# Altium schematic sheet OLD_REGENIX_Relais.SchDoc
size Tabloid; Date: Date; Author: Author 1; DocumentNumber: 2; Revision: 1; SheetNumber: 6; SheetTotal: 12; Size: 11x17; Sheet_Name: BATTERY PROTECTION & AUXILIARY
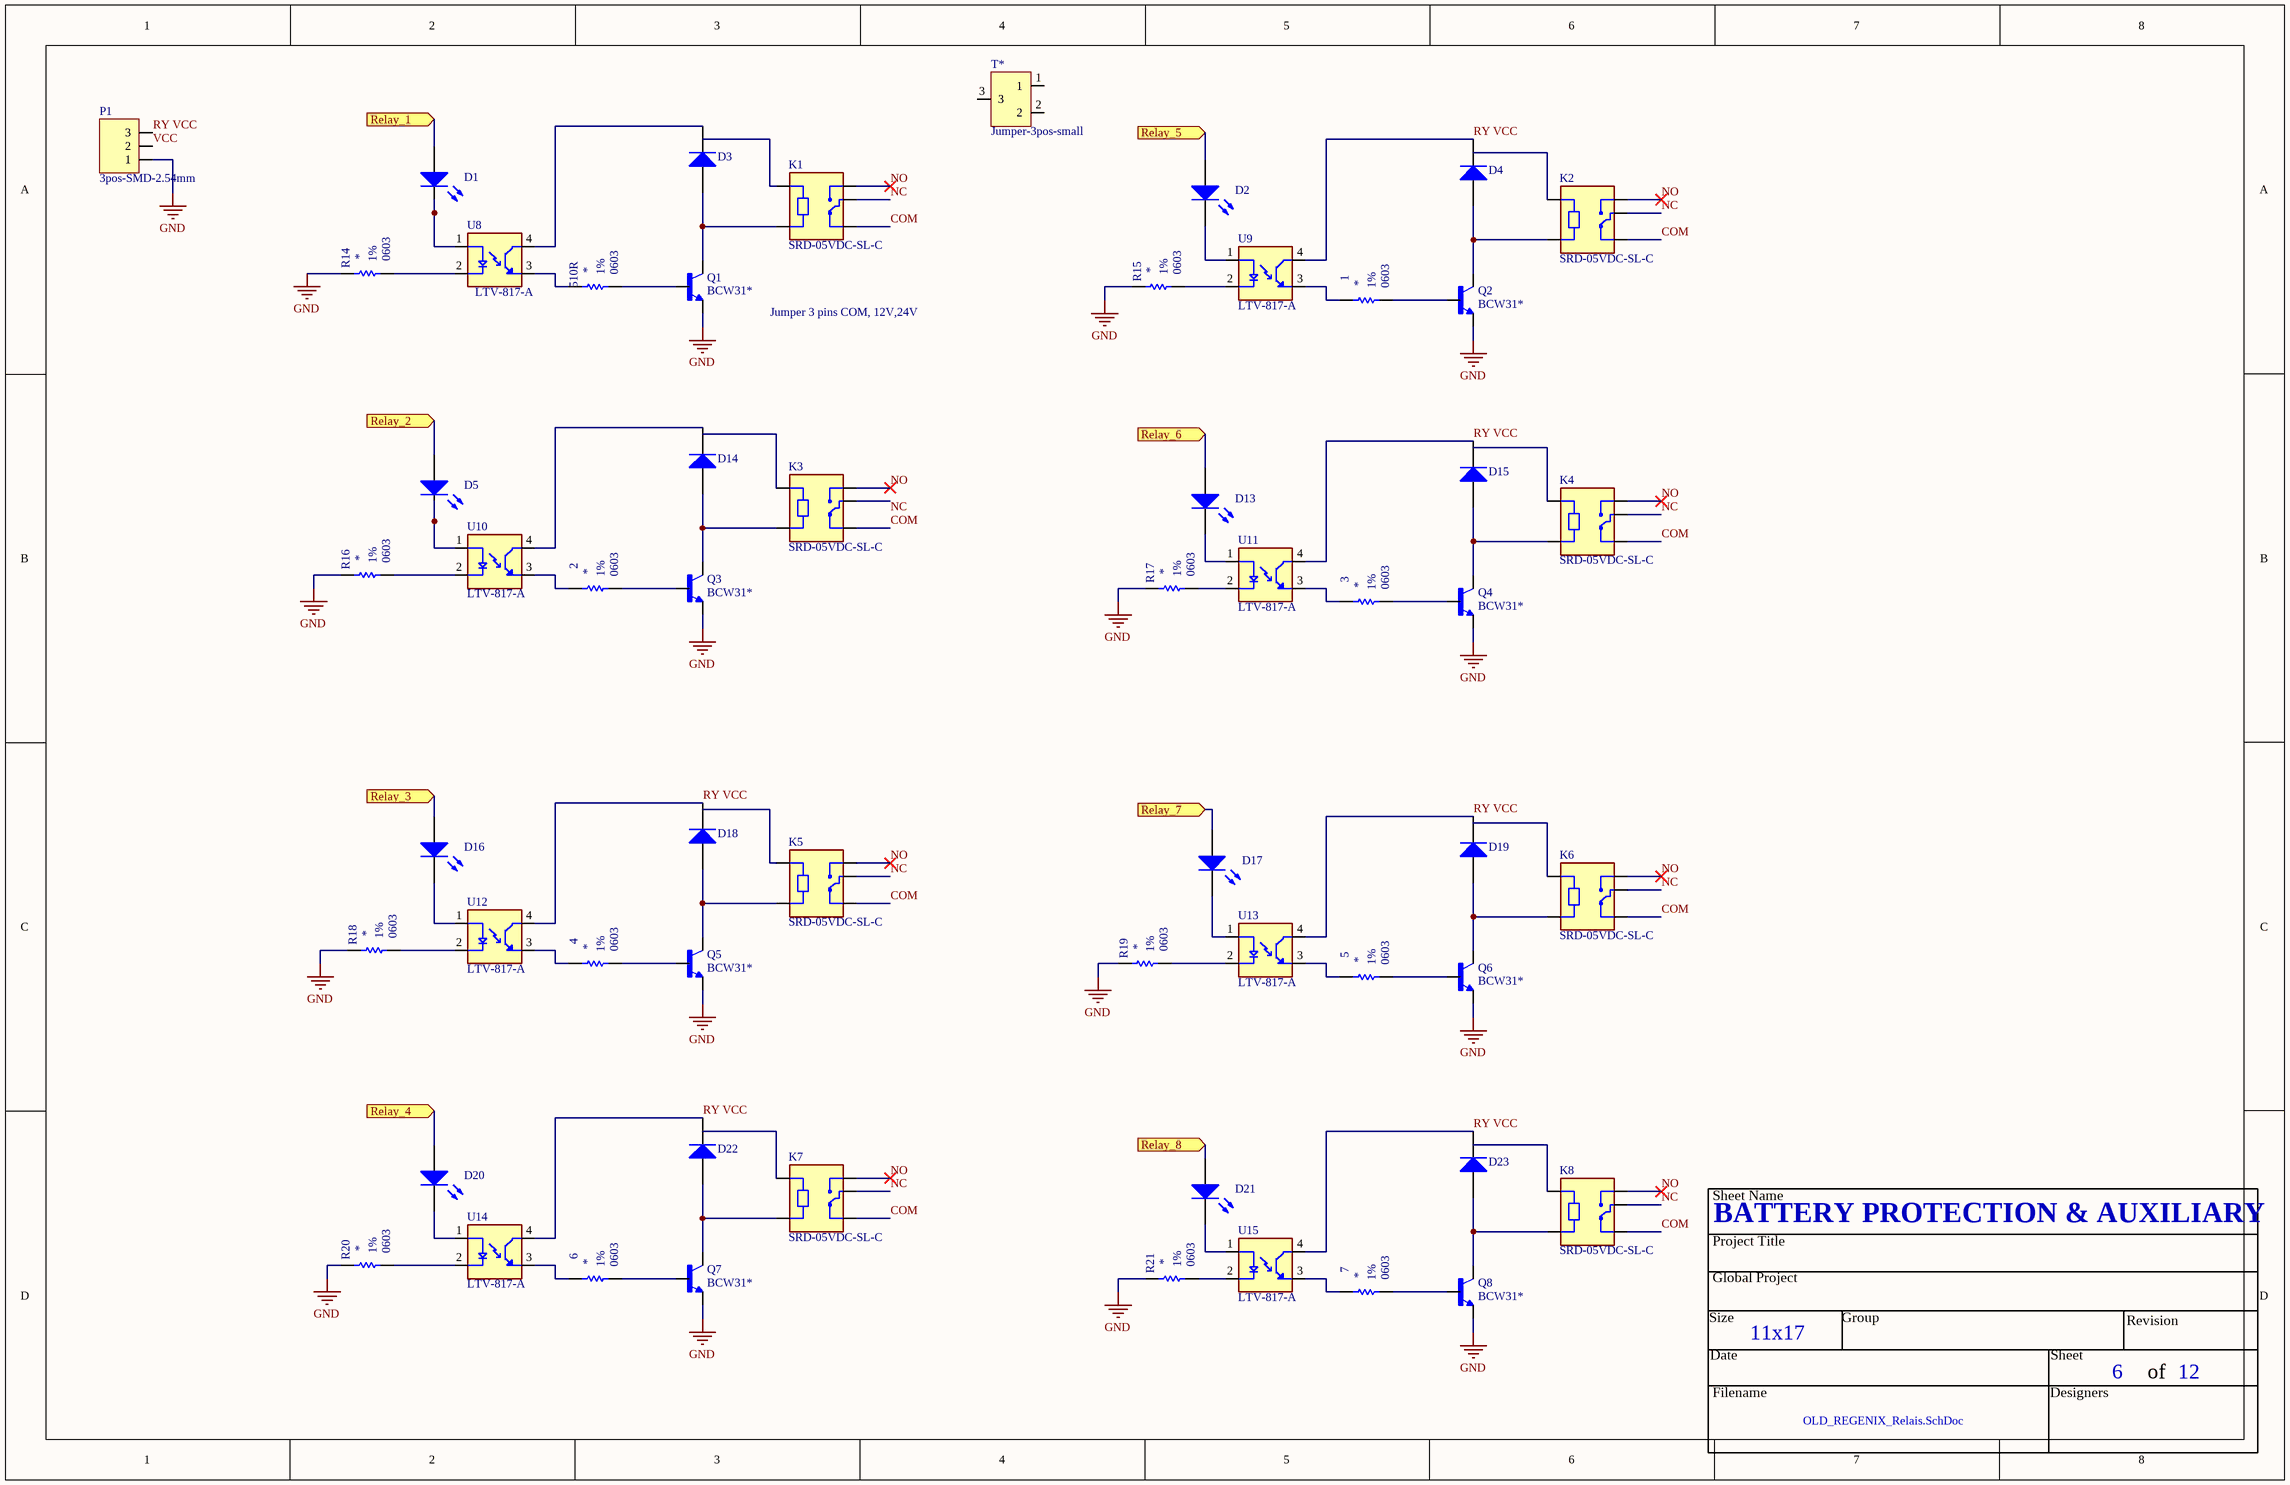
[diagram p0: OLD_REGENIX_Relais.SchDoc]

## Parts
1  Package: 0603  Precision: 1%  [RES_0603]  (hidden comment: RES - 0603)
2  Package: 0603  Precision: 1%  [RES_0603]  (hidden comment: RES - 0603)
3  Package: 0603  Precision: 1%  [RES_0603]  (hidden comment: RES - 0603)
4  Package: 0603  Precision: 1%  [RES_0603]  (hidden comment: RES - 0603)
5  Package: 0603  Precision: 1%  [RES_0603]  (hidden comment: RES - 0603)
6  Package: 0603  Precision: 1%  [RES_0603]  (hidden comment: RES - 0603)
7  Package: 0603  Precision: 1%  [RES_0603]  (hidden comment: RES - 0603)
510R  Package: 0603  Precision: 1%  [RES_0603]  (hidden comment: RES - 0603)
D1  Light-Emitting Diode  (value not drawn)
D2  Light-Emitting Diode  (value not drawn)
D3  Diode  (value not drawn)
D4  Diode  (value not drawn)
D5  Light-Emitting Diode  (value not drawn)
D13  Light-Emitting Diode  (value not drawn)
D14  Diode  (value not drawn)
D15  Diode  (value not drawn)
D16  Light-Emitting Diode  (value not drawn)
D17  Light-Emitting Diode  (value not drawn)
D18  Diode  (value not drawn)
D19  Diode  (value not drawn)
D20  Light-Emitting Diode  (value not drawn)
D21  Light-Emitting Diode  (value not drawn)
D22  Diode  (value not drawn)
D23  Diode  (value not drawn)
K1  SRD-05VDC-SL-C  [RELAY_SRD-05VDC-SL-C]
K2  SRD-05VDC-SL-C  [RELAY_SRD-05VDC-SL-C]
K3  SRD-05VDC-SL-C  [RELAY_SRD-05VDC-SL-C]
K4  SRD-05VDC-SL-C  [RELAY_SRD-05VDC-SL-C]
K5  SRD-05VDC-SL-C  [RELAY_SRD-05VDC-SL-C]
K6  SRD-05VDC-SL-C  [RELAY_SRD-05VDC-SL-C]
K7  SRD-05VDC-SL-C  [RELAY_SRD-05VDC-SL-C]
K8  SRD-05VDC-SL-C  [RELAY_SRD-05VDC-SL-C]
P1  3pos-SMD-2.54mm  [HDR1X3 - PAD]
Q1  BCW31*  [SOT23-BEC]
Q2  BCW31*  [SOT23-BEC]
Q3  BCW31*  [SOT23-BEC]
Q4  BCW31*  [SOT23-BEC]
Q5  BCW31*  [SOT23-BEC]
Q6  BCW31*  [SOT23-BEC]
Q7  BCW31*  [SOT23-BEC]
Q8  BCW31*  [SOT23-BEC]
R14  Package: 0603  Precision: 1%  [RES_0603]  (hidden comment: RES - 0603)
R15  Package: 0603  Precision: 1%  [RES_0603]  (hidden comment: RES - 0603)
R16  Package: 0603  Precision: 1%  [RES_0603]  (hidden comment: RES - 0603)
R17  Package: 0603  Precision: 1%  [RES_0603]  (hidden comment: RES - 0603)
R18  Package: 0603  Precision: 1%  [RES_0603]  (hidden comment: RES - 0603)
R19  Package: 0603  Precision: 1%  [RES_0603]  (hidden comment: RES - 0603)
R20  Package: 0603  Precision: 1%  [RES_0603]  (hidden comment: RES - 0603)
R21  Package: 0603  Precision: 1%  [RES_0603]  (hidden comment: RES - 0603)
T*  Jumper-3pos-small  [Jumper-3pos-small]
U8  LTV-817-A  [DIP762W50P254L510H500Q4]
U9  LTV-817-A  [DIP762W50P254L510H500Q4]
U10  LTV-817-A  [DIP762W50P254L510H500Q4]
U11  LTV-817-A  [DIP762W50P254L510H500Q4]
U12  LTV-817-A  [DIP762W50P254L510H500Q4]
U13  LTV-817-A  [DIP762W50P254L510H500Q4]
U14  LTV-817-A  [DIP762W50P254L510H500Q4]
U15  LTV-817-A  [DIP762W50P254L510H500Q4]

## Ports
Relay_1 (in), Relay_2 (in), Relay_3 (in), Relay_4 (in), Relay_5 (in), Relay_6 (in), Relay_7 (in), Relay_8 (in)

## Nets
GND: P1.1 Q1.E Q2.E Q3.E Q4.E Q5.E Q6.E Q7.E Q8.E R14.2 R15.2 R16.2 R17.2 R18.2 R19.2 R20.2 R21.2
COM: K1.NC K2.NC K3.NC K4.NC K5.NC K6.NC K7.NC K8.NC
NC: K1.COM K2.COM K4.COM K5.COM K6.COM K7.COM K8.COM
NO: K1.NO K2.NO K3.NO K4.NO K5.NO K6.NO K7.NO K8.NO
Relay_1: D1.1(A) ; port Relay_1
Relay_2: D5.1(A) ; port Relay_2
Relay_3: D16.1(A) ; port Relay_3
Relay_4: D20.1(A) ; port Relay_4
Relay_5: D2.1(A) ; port Relay_5
Relay_6: D13.1(A) ; port Relay_6
Relay_7: D17.1(A) ; port Relay_7
Relay_8: D21.1(A) ; port Relay_8
RY VCC: D4.2(K) D15.2(K) D18.2(K) D19.2(K) D22.2(K) D23.2(K) P1.3 U9.4(CT) U11.4(CT) U12.4(CT) U13.4(CT) U14.4(CT) U15.4(CT)
VCC: P1.2
Net1_1: 1.1 Q2.B
Net1_2: 1.2 U9.3(ET)
Net2_1: 2.1 Q3.B
Net2_2: 2.2 U10.3(ET)
Net3_1: 3.1 Q4.B
Net3_2: 3.2 U11.3(ET)
Net4_1: 4.1 Q5.B
Net4_2: 4.2 U12.3(ET)
Net5_1: 5.1 Q6.B
Net5_2: 5.2 U13.3(ET)
Net6_1: 6.1 Q7.B
Net6_2: 6.2 U14.3(ET)
Net7_1: 7.1 Q8.B
Net7_2: 7.2 U15.3(ET)
Net510R_1: 510R.1 Q1.B
Net510R_2: 510R.2 U8.3(ET)
NetD1_2: D1.2(K) U8.1(A)
NetD2_2: D2.2(K) U9.1(A)
NetD3_1: D3.1(A) K1.A2 Q1.C
NetD3_2: D3.2(K) U8.4(CT)
NetD4_1: D4.1(A) K2.A2 Q2.C
NetD5_2: D5.2(K) U10.1(A)
NetD13_2: D13.2(K) U11.1(A)
NetD14_1: D14.1(A) K3.A2 Q3.C
NetD14_2: D14.2(K) U10.4(CT)
NetD15_1: D15.1(A) K4.A2 Q4.C
NetD16_2: D16.2(K) U12.1(A)
NetD17_2: D17.2(K) U13.1(A)
NetD18_1: D18.1(A) K5.A2 Q5.C
NetD19_1: D19.1(A) K6.A2 Q6.C
NetD20_2: D20.2(K) U14.1(A)
NetD21_2: D21.2(K) U15.1(A)
NetD22_1: D22.1(A) K7.A2 Q7.C
NetD23_1: D23.1(A) K8.A2 Q8.C
NetR14_1: R14.1 U8.2(C)
NetR15_1: R15.1 U9.2(C)
NetR16_1: R16.1 U10.2(C)
NetR17_1: R17.1 U11.2(C)
NetR18_1: R18.1 U12.2(C)
NetR19_1: R19.1 U13.2(C)
NetR20_1: R20.1 U14.2(C)
NetR21_1: R21.1 U15.2(C)

Not connected (* = marked no-connect by the designer): K1 A1; K2 A1; K3 A1 COM; K4 A1; K5 A1; K6 A1; K7 A1; K8 A1; T* 1 2 3

## Notes on the sheet
- Jumper 3 pins COM, 12V,24V
- Labels drawn without touching a wire or pin: NC
- Sheet Name
- Project Title
- Global Project
- Revision
- Size
- Date
- Group
- Sheet
- of
- Filename
- Designers

## Library data of the parts
D1 D2 D5 D13 D16 D17 D20 D21 = LED: AF: 1; BV: 0; BV_MAX: 1e99; EG: 1.11; FC: 0.5; IBV: 0.001; IS: 1e-14; MJSW: 0.33; NTUN: 30; TNOM: 27; XTI: 3; SimulationGenericComponent: True; CJO: 0; CJP: 0; CTA: 0; CTP: 0; FCS: 0.5; FV_MAX: 1e99; IKF: 0; IKR: 0; ISR: 1e-14; JSW: 0; JTUN: 0; JTUNSW: 0; KEG: 1; KF: 0; LEVEL: 1; N: 1; NBV: 1; NR: 1; NS: 1; PHP: 1; RS: 0; TCV: 0; TLEV: 0; TLEVC: 0; TM1: 0; TM2: 0; TPB: 0; TPHP: 0; TRS: 0; TRS2: 0; TT: 0; TTT1: 0; TTT2: 0; VJ: 1; XTITUN: 3
D3 D4 D14 D15 D18 D19 D22 D23 = Diode: AF: 1; BV: 0; BV_MAX: 1e99; EG: 1.11; FC: 0.5; IBV: 0.001; ISR: 1e-14; MJSW: 0.33; NTUN: 30; TNOM: 27; XTI: 3; SimulationGenericComponent: True; CJO: 0; CJP: 0; CTA: 0; CTP: 0; FCS: 0.5; FV_MAX: 1e99; IKF: 0; IKR: 0; JSW: 0; JTUN: 0; JTUNSW: 0; KEG: 1; KF: 0; LEVEL: 1; N: 1; NBV: 1; NR: 1; NS: 1; PHP: 1; RS: 0; TCV: 0; TLEV: 0; TLEVC: 0; TM1: 0; TM2: 0; TPB: 0; TPHP: 0; TRS: 0; TRS2: 0; TT: 0; TTT1: 0; TTT2: 0; VJ: 1; XTITUN: 3; IS: 1e-14
K1-K8 = SRD-05VDC-SL-C: 5V Trigger Relay Module For Arduino And Raspberry Pi 5V Trigger Relay Module For Arduino And Raspberry Pi; MF: Songle Relay; Check_prices: https://www.snapeda.com/parts/SRD-05VDC-SL-C/Songle+Relay/view-part/?ref=eda; Value: *; Availability: Not in stock; Price: None; Package: NON STANDARD-5 Songle Relay; MP: SRD-05VDC-SL-C; SnapEDA_Link: https://www.snapeda.com/parts/SRD-05VDC-SL-C/Songle+Relay/view-part/?ref=snap
P1 = 3pos-SMD-2.54mm_1: 3pos SMD 2.54mm Header; Supplier 1: Digi-Key; Supplier Part Number 1: N/A; Mounted: Yes; Package / Case: SMD; Volt: N/A
Q1-Q8 = BCW31*: â€¢ This device is designed for general purpose amplifier applications at collector currents to 300 mA. â€¢ Sourced from process 10.; MF: Fairchild Semiconductor; MP: BCW31; SnapEDA_Link: https://www.snapeda.com/parts/BCW31/Fairchild+Imaging/view-part/?ref=snap; Package: SOT-23 Diodes Inc.; Value: *; Check_prices: https://www.snapeda.com/parts/BCW31/Fairchild+Imaging/view-part/?ref=eda
U8-U15 = LTV-817-A: Optoisolator Transistor Output 5000Vrms 1 Channel 4-DIP; MF: Lite-On Inc.; SnapEDA_Link: https://www.snapeda.com/parts/LTV-817-A/Lite-On/view-part/?ref=snap; Package: DIP-4 Lite-On; Value: *; MP: LTV-817-A; Check_prices: https://www.snapeda.com/parts/LTV-817-A/Lite-On/view-part/?ref=eda
1-7 510R R14-R21 = RES - 0603: Current: *; CreatedBy: Jonathan Bouchard; Value: *